# EasyEDA schematic SCH_Transmitter_PCB.json
TITLE: Sheet_1; REV: 1.0; Date: 2025-01-23; Sheet: 1/1; Drawn By: indimasti; Company: Your Company
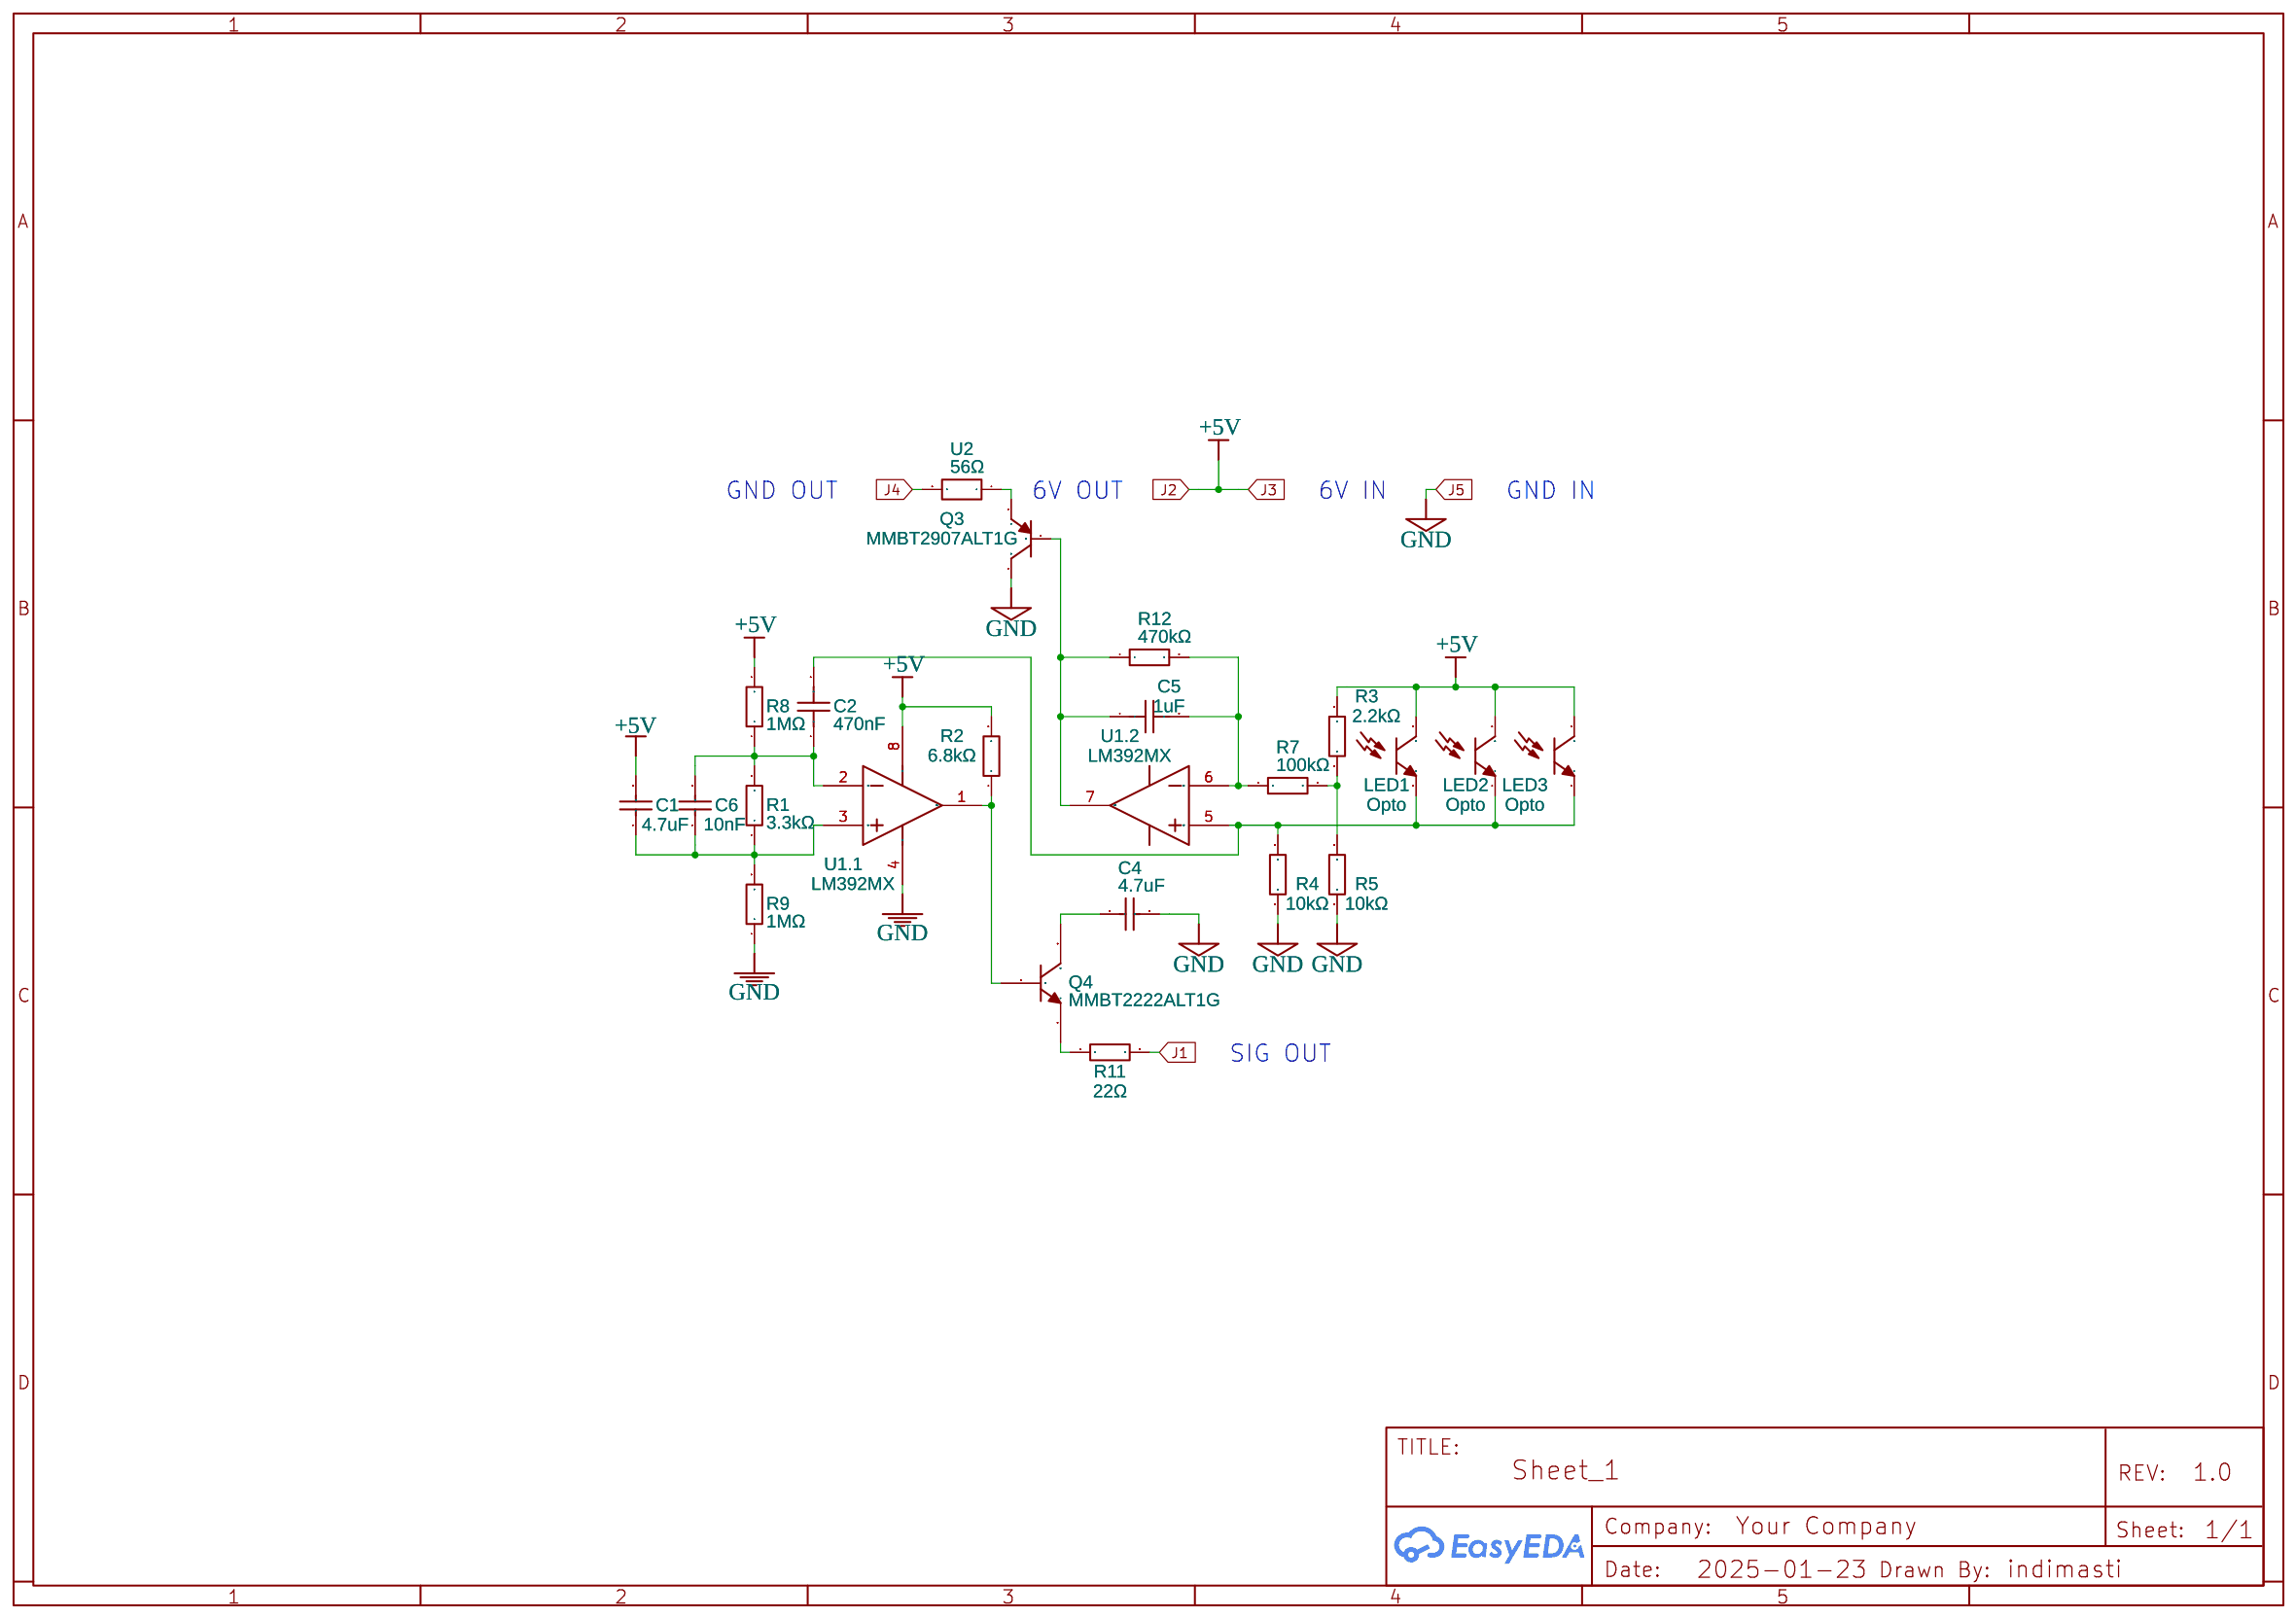
[diagram p0: schematic sheet]

## Parts
C1  4.7uF  [C0603]
C2  470nF  [C0603]
C4  4.7uF  [C0603]
C5  1uF  [C0603]
C6  10nF  [C0603]
LED1  Opto  [LED-TH_BD5.8-P2.54-RD]
LED2  Opto  [LED-TH_BD5.8-P2.54-RD]
LED3  Opto  [LED-TH_BD5.8-P2.54-RD]
Q3  MMBT2907ALT1G  [SOT-23-3_L2.9-W1.3-P1.90-LS2.4-BR]
Q4  MMBT2222ALT1G  [SOT-23-3_L2.9-W1.3-P1.90-LS2.4-BR]
R1  3.3kΩ  [R0603]
R2  6.8kΩ  [R0603]
R3  2.2kΩ  [R0603]
R4  10kΩ  [R0603]
R5  10kΩ  [R0603]
R7  100kΩ  [R0603]
R8  1MΩ  [R0603]
R9  1MΩ  [R0603]
R11  22Ω  [R0603]
R12  470kΩ  [R0603]
U1  LM392MX  [SOIC-8_L5.0-W4.0-P1.27-LS6.0-BL]  (sections 1,2)
U2  56Ω  [R0603]

## Library data of the parts
C1 C4 = CC0603KRX5R6BB475: JLCPCB Part Class: Extended Part; Supplier: LCSC; Manufacturer: YAGEO(国巨); Supplier Part: C109456
C2 = CC0603KRX7R8BB474_C326058: Contributor: LCSC; Supplier: LCSC; Supplier Part: C326058; Manufacturer: YAGEO(国巨); Manufacturer Part: CC0603KRX7R8BB474; JLCPCB Part Class: Extended Part
C5 = CC0603KRX7R9BB105: Contributor: LCSC; Supplier: LCSC; Supplier Part: C559769; Manufacturer: YAGEO(国巨); JLCPCB Part Class: Extended Part
C6 = CC0603KRX7R9BB103: Supplier: LCSC; Manufacturer: YAGEO(国巨); Supplier Part: C100042; JLCPCB Part Class: Extended Part
LED1-LED3 = MHL524PT03BRT: Contributor: LCSC; Supplier: LCSC; Supplier Part: C405261; Manufacturer: MEIHUA(美华); JLCPCB Part Class: Extended Part
Q3 = MMBT2907ALT1G: Supplier: LCSC; Manufacturer: onsemi(安森美); Supplier Part: C40752; JLCPCB Part Class: Extended Part
Q4 = MMBT2222ALT1G: Supplier: LCSC; Manufacturer: onsemi(安森美); Supplier Part: C82460; JLCPCB Part Class: Extended Part
R1 = RT0603BRD073K3L: Contributor: LCSC; Supplier: LCSC; Supplier Part: C309653; Manufacturer: YAGEO(国巨); JLCPCB Part Class: Extended Part
R2 = RC0603FR-076K8L: Supplier: LCSC; Manufacturer: YAGEO(国巨); Supplier Part: C114632; JLCPCB Part Class: Extended Part
R3 = RC0603FR-072K2L: Supplier: LCSC; Manufacturer: YAGEO(国巨); Supplier Part: C114662; JLCPCB Part Class: Extended Part
R4 R5 = RC0603FR-0710KL: Supplier: LCSC; Manufacturer: YAGEO(国巨); Supplier Part: C98220; JLCPCB Part Class: Extended Part
R7 = RC0603FR-07100KL: Contributor: LCSC; Supplier: LCSC; Supplier Part: C14675; Manufacturer: YAGEO(国巨); JLCPCB Part Class: Extended Part
R8 R9 = RT0603BRD071ML: Contributor: LCSC; Supplier: LCSC; Supplier Part: C326730; Manufacturer: YAGEO(国巨); JLCPCB Part Class: Extended Part
R11 = RC0603FR-0722RL: Supplier: LCSC; Manufacturer: YAGEO(国巨); Supplier Part: C107701; JLCPCB Part Class: Extended Part
R12 = RC0603FR-07470KL: Supplier: LCSC; Manufacturer: YAGEO(国巨); Supplier Part: C114622; JLCPCB Part Class: Extended Part
U1 = LM392MX: tags: Others; subpart_no: 1; image: http://image.lceda.cn/szlcsc/C7954.jpg; Supplier Part: C7954; Supplier: LCSC; Manufacturer: TI(德州仪器); Manufacturer Part: LM392MX/NOPB; JLCPCB Part Class: Extended Part
U2 = RT0603BRB0756RL: Supplier: LCSC; Supplier Part: C860447; Manufacturer: YAGEO(国巨); JLCPCB Part Class: Extended Part; Contributor: lcsc

## Nets
+5V: C1.2 LED1.2(C) LED2.2(C) LED3.2(C) R2.2 R3.1 R8.2 U1.8(V+)
GND: C4.1 Q3.3(C) R4.1 R5.1 R9.1 U1.4(GND)
J1: R11.2
J4: U2.2
Net-(C1-1): C1.1 C6.1 R1.1 R9.2 U1.3(INA+)
Net-(C2-1): C2.1 C6.2 R1.2 R8.1 U1.2(INA-)
Net-(C2-2): C2.2 LED1.1(E) LED2.1(E) LED3.1(E) R4.2 U1.5(INB+)
Net-(C4-2): C4.2 Q4.3(C)
Net-(C5-1): C5.1 Q3.1(B) R12.1 U1.7(OUTB)
Net-(C5-2): C5.2 R7.1 R12.2 U1.6(INB-)
Net-(Q3-2): Q3.2(E) U2.1
Net-(Q4-1): Q4.1(B) R2.1 U1.1(OUTA)
Net-(Q4-2): Q4.2(E) R11.1
Net-(R3-2): R3.2 R5.2 R7.2

## Notes on the sheet
- GND OUT
- 6V OUT
- 6V IN
- GND IN
- SIG OUT
